# Altium schematic sheet MCU.SchDoc
size A4; SheetNumber: 1; SheetTotal: 4
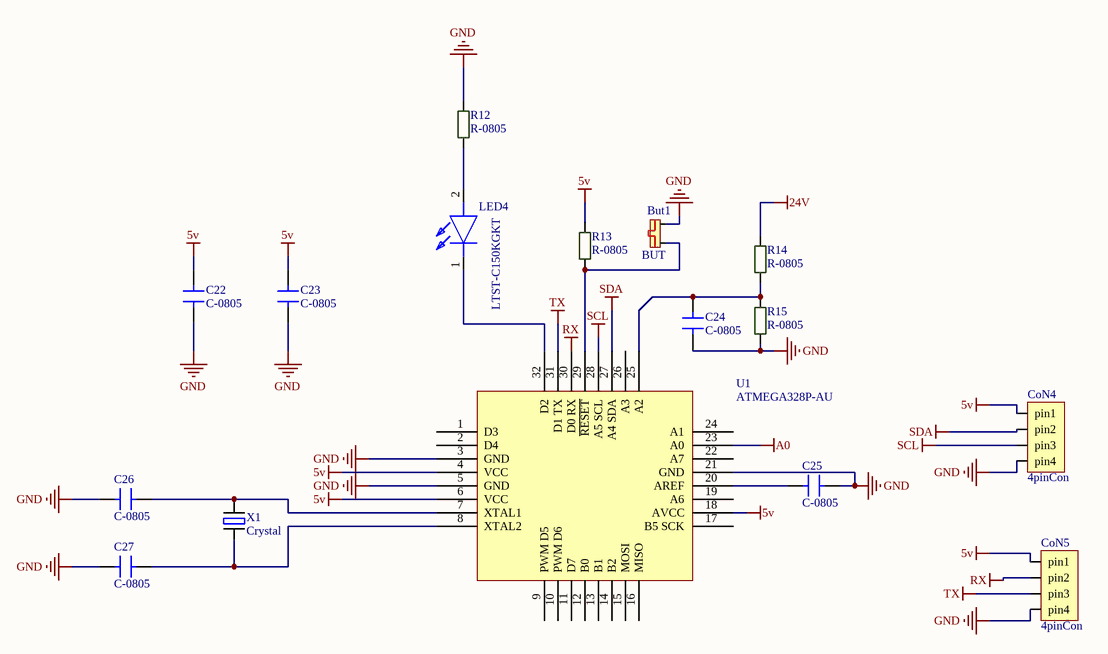
[diagram p0: MCU.SchDoc]

## Parts
But1  BUT  [ButTON]
C22  C-0805  [C-0805W]
C23  C-0805  [C-0805W]
C24  C-0805  [C-0805W]
C25  C-0805  [C-0805W]
C26  C-0805  [C-0805W]
C27  C-0805  [C-0805W]
CoN4  4pinCon  [4pinCon]
CoN5  4pinCon  [4pinCon]
LED4  LTST-C150KGKT  [LED1206]
R12  R-0805  [R-0805W]
R13  R-0805  [R-0805W]
R14  R-0805  [R-0805W]
R15  R-0805  [R-0805W]
U1  ATMEGA328P-AU  [TQFP80P900X900X120-32N]
X1  Crystal  [crystal]

## Nets
5v: C22.2 C23.2 CoN4.1(pin1) CoN5.1(pin1) R13.2 U1.4(VCC) U1.6(VCC) U1.18(AVCC)
24V: R14.2
A0: U1.23(A0)
GND: But1.2 C22.1 C23.1 C24.1 C25.2 C26.1 C27.1 CoN4.4(pin4) CoN5.4(pin4) R12.2 R15.1 U1.3(GND) U1.5(GND) U1.21(GND)
RX: CoN5.2(pin2) U1.30(D0_RX)
SCL: CoN4.3(pin3) U1.28(A5_SCL)
SDA: CoN4.2(pin2) U1.27(A4_SDA)
TX: CoN5.3(pin3) U1.31(D1_TX)
NetBut1_1: But1.1 R13.1 U1.29(~{RESET})
NetC24_2: C24.2 R14.1 R15.2 U1.25(A2)
NetC25_1: C25.1 U1.20(AREF)
NetC26_2: C26.2 U1.7(XTAL1) X1.1
NetC27_2: C27.2 U1.8(XTAL2) X1.2
NetLED4_1: LED4.1(K) U1.32(D2)
NetLED4_2: LED4.2(A) R12.1

Not connected (* = marked no-connect by the designer): U1 1(D3) 2(D4) 9(PWM_D5) 10(PWM_D6) 11(D7) 12(B0) 13(B1) 14(B2) 15(MOSI) 16(MISO) 17(B5_SCK) 19(A6) 22(A7) 24(A1) 26(A3)

## Library data of the parts
LED4 = LTST-C150KGKT: LED; Manufacturer_Name: Lite-On; Datasheet Link: http://optoelectronics.liteon.com/upload/download/ds22-2000-072/ltst-c150kgkt.pdf; Height: 1.2mm; Manufacturer_Part_Number: LTST-C150KGKT; Mouser Part Number: 859-LTST-C150KGKT; Mouser Price/Stock: https://www.mouser.com/Search/Refine.aspx?Keyword=859-LTST-C150KGKT; RS Part Number: 6920871; RS Price/Stock: https://uk.rs-online.com/web/p/products/6920871
U1 = ATMEGA328P-AU: Microchip Technology ATMEGA328P-AN, 8bit AVR Microcontroller, 20MHz, 32 kB Flash, 32-Pin TQFP
X1 = Crystal: AS49SD-16M-FC160F3-TR